# Altium schematic sheet CH32F103C-R1.SchDoc
size 436 x 317 mm
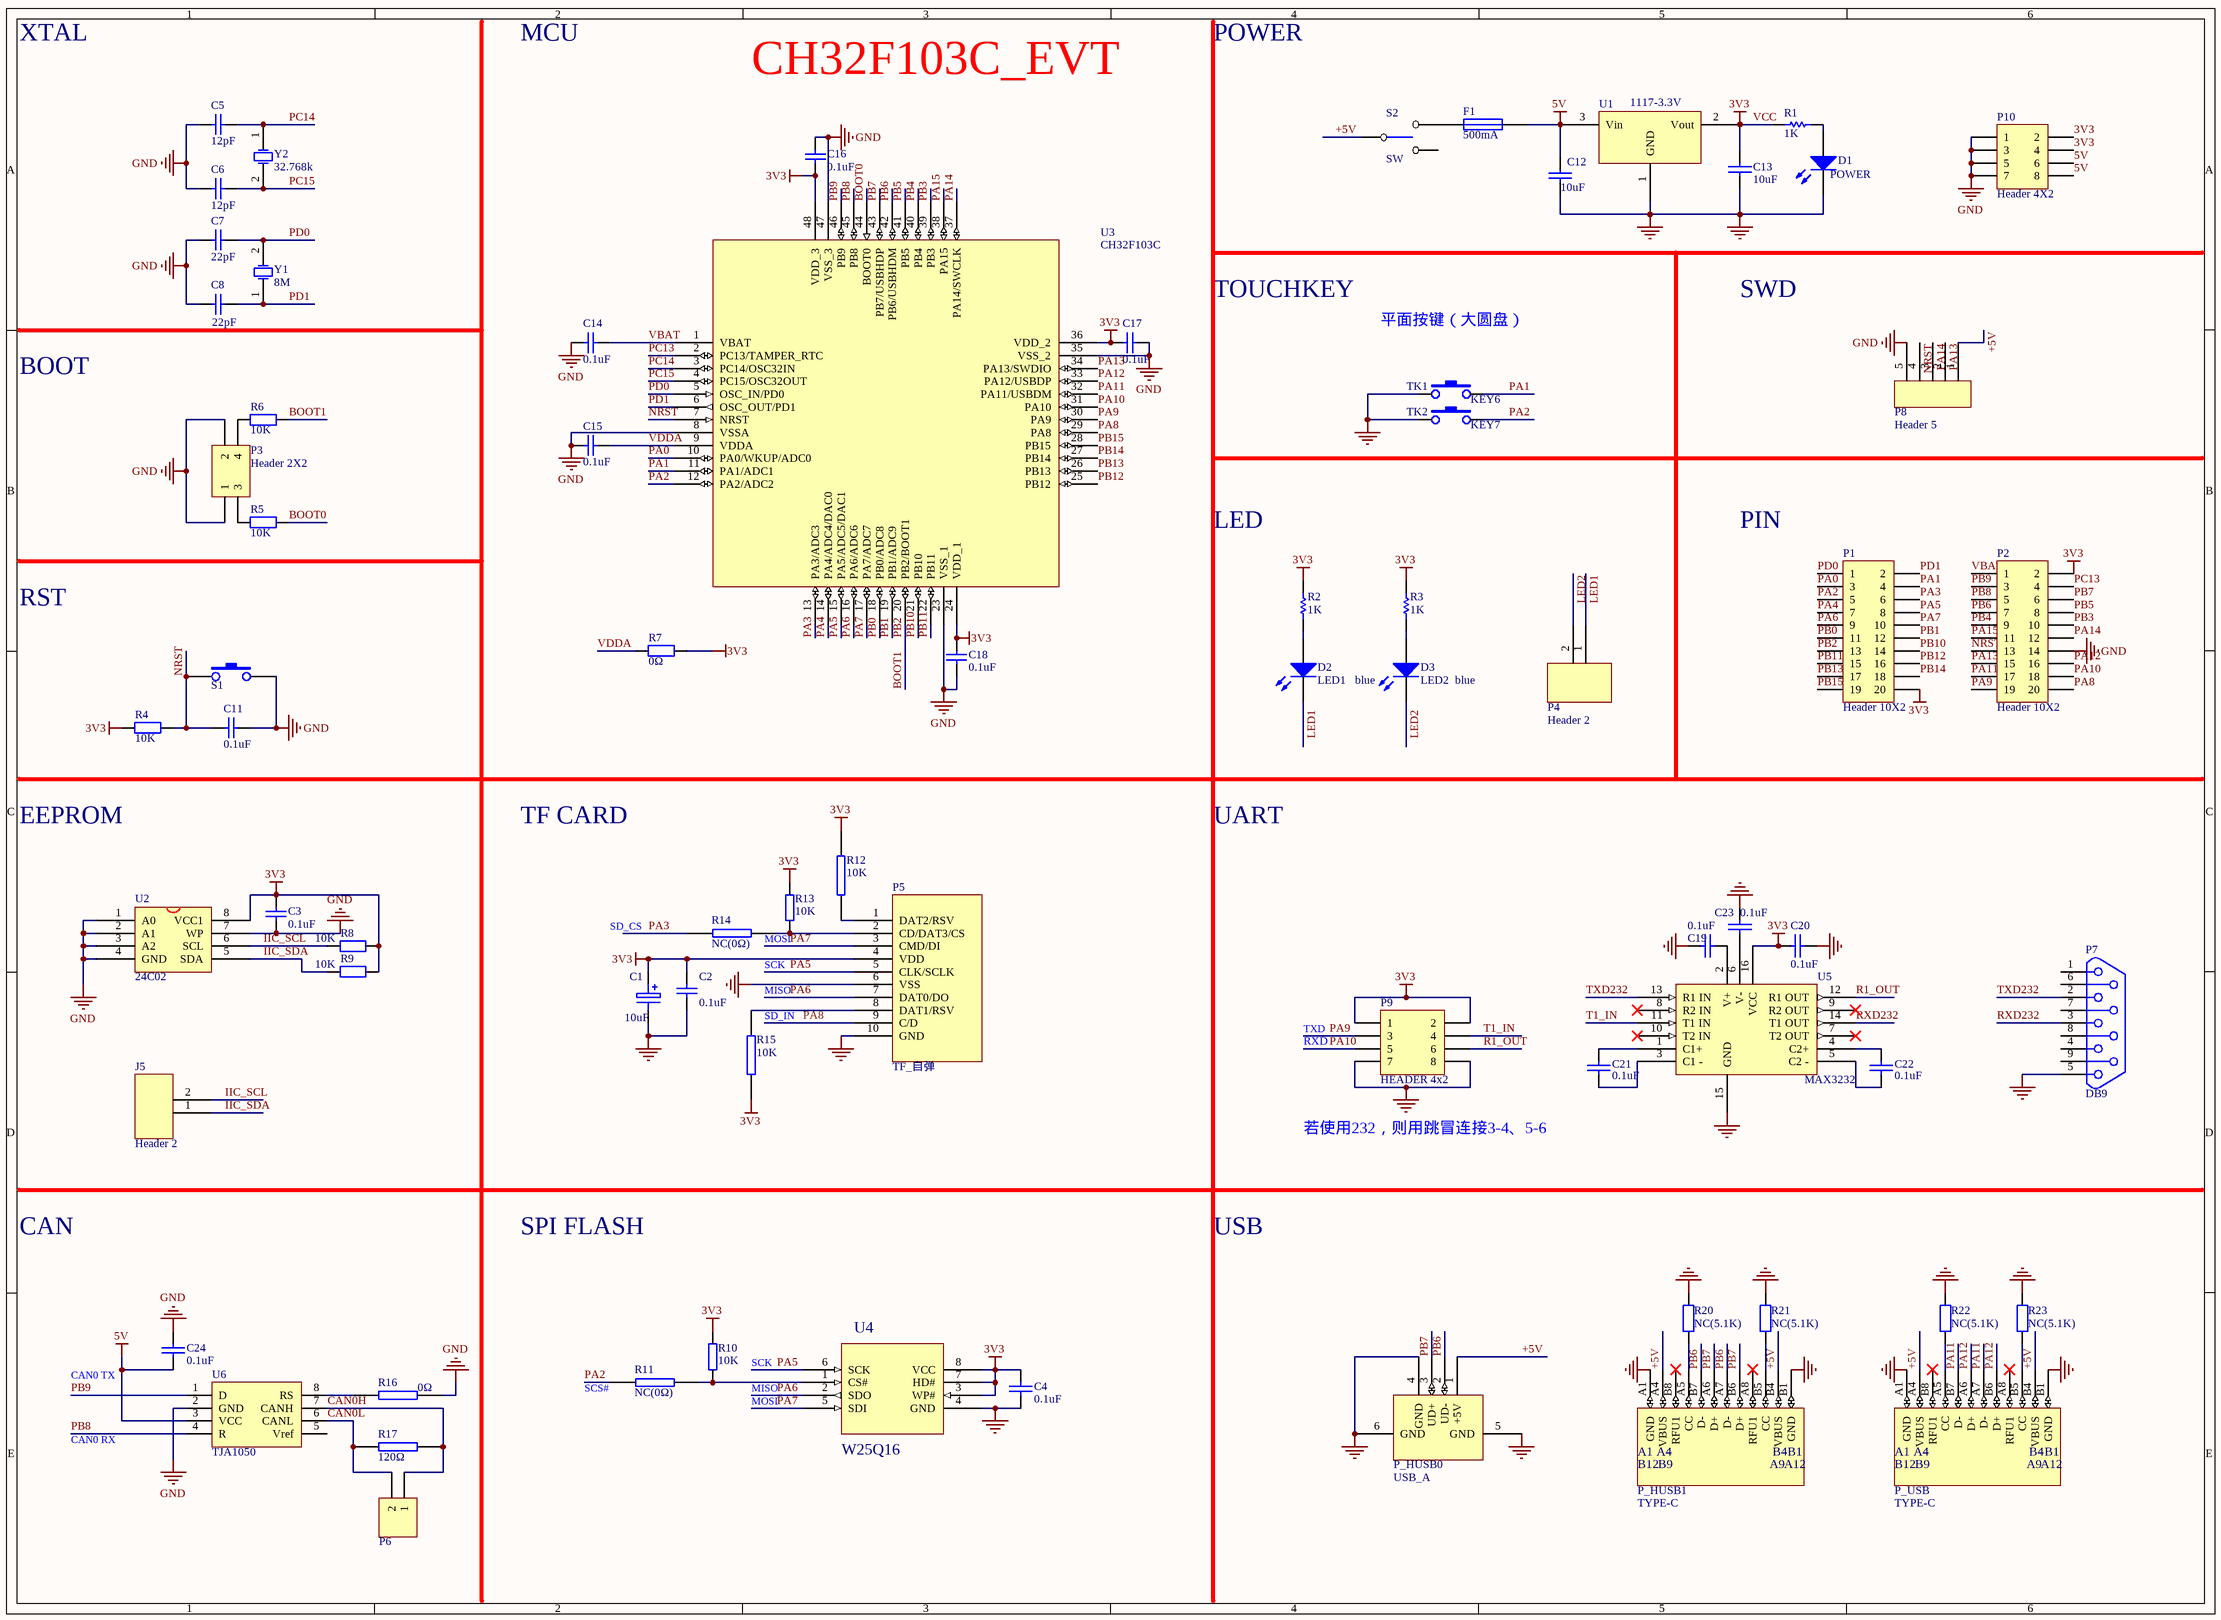
[diagram p0: CH32F103C-R1.SchDoc]

## Parts
C1  10uF  [3216]
C2  0.1uF  [0603]
C3  0.1uF  [0603]
C4  0.1uF  [0603]
C5  12pF  [0603]
C6  12pF  [0603]
C7  22pF  [0603]
C8  22pF  [0603]
C11  0.1uF  [0603]
C12  10uF  [3216]
C13  10uF  [0603]
C14  0.1uF  [0603]
C15  0.1uF  [0603]
C16  0.1uF  [0603]
C17  0.1uF  [0603]
C18  0.1uF  [0603]
C19  0.1uF  [0603]
C20  0.1uF  [0603]
C21  0.1uF  [0603]
C22  0.1uF  [0603]
C23  0.1uF  [0603]
C24  0.1uF  [0603]
D1  POWER  [0603L]
D2  LED1   blue  [0603L]
D3  LED2  blue  [0603L]
F1  500mA  [0603]
J5  Header 2  [SIP2 - 40mil]
P1  Header 10X2  [IDC20]
P2  Header 10X2  [IDC20]
P3  Header 2X2  [HDR2X2]
P4  Header 2  [SIP2 - 40mil]
P5  TF_自弹  [TF_CARD]
P6  Header 2  [PORT2 4.5MM]  (value not drawn)
P7  DB9  [DB9]
P8  Header 5  [SIP5 - 40mil]
P9  HEADER 4x2  [IDC8-2.54mm]
P10  Header 4X2  [IDC8]
P_HUSB0  USB_A  [USBA-l]
P_HUSB1  TYPE-C  [TYPE-C-Receptacle-2.0]
P_USB  TYPE-C  [TYPE-C-Receptacle-2.0]
R1  1K  [0603]
R2  1K  [0603]
R3  1K  [0603]
R4  10K  [0603]
R5  10K  [0603]
R6  10K  [0603]
R7  0Ω  [0603]
R8  10K  [0603]
R9  10K  [0603]
R10  10K  [0603]
R11  NC(0Ω)  [0603]
R12  10K  [0603]
R13  10K  [0603]
R14  NC(0Ω)  [0603]
R15  10K  [0603]
R16  0Ω  [0603]
R17  120Ω  [0603]
R20  NC(5.1K)  [0603]
R21  NC(5.1K)  [0603]
R22  NC(5.1K)  [0603]
R23  NC(5.1K)  [0603]
S1  KEY  [贴片按键]  (value not drawn)
S2  SW  [KEY2]
TK1  KEY6  [KEY68]
TK2  KEY7  [KEY68]
U1  1117-3.3V  [SOT-223]
U2  24C02  [SOP8]
U3  CH32F103C  [LQFP48]
U4  W25Q16  [016 SO-8]
U5  MAX3232  [SO-16]
U6  TJA1050  [SOP8]
Y1  8M  [XT62/28]
Y2  32.768k  [FC-135]

## Nets
3V3: C1.1 C2.1 C3.2 C4.2 C13.1 C16.2 C17.2 C18.2 C20.2 P1.20 P2.2 P5.4(VDD) P9.1 P9.2 P10.2 P10.4 R1.2 R2.1 R3.1 R4.2 R7.1 R8.1 R9.1 R10.2 R12.2 R13.2 R15.1 U1.2(Vout) U2.8(VCC1) U3.24(VDD_1) U3.36(VDD_2) U3.48(VDD_3) U4.3(WP#) U4.7(HD#) U4.8(VCC) U5.16(VCC)  [also labelled VCC]
5V: C12.1 C24.2 F1.2 P10.6 P10.8 U1.3(Vin) U6.3(VCC)
GND: C1.2 C2.2 C3.1 C4.1 C5.2 C6.2 C7.1 C8.1 C11.1 C12.2 C13.2 C14.2 C15.2 C16.1 C17.1 C18.1 C19.2 C20.1 C23.2 C24.1 D1.2(K) P2.14 P3.1 P3.2 P5.6(VSS) P5.10(GND) P7.5 P8.5 P9.7 P9.8 P10.1 P10.3 P10.5 P10.7 P_HUSB0.4(GND) P_HUSB0.5(GND) P_HUSB0.6(GND) P_HUSB1.A1(GND) P_HUSB1.B1(GND) P_USB.A1(GND) P_USB.B1(GND) R16.1 R20.2 R21.2 R22.2 R23.2 S1.3 TK1.3 TK2.3 U1.1(GND) U2.1(A0) U2.2(A1) U2.3(A2) U2.4(GND) U2.7(WP) U3.8(VSSA) U3.23(VSS_1) U3.35(VSS_2) U3.47(VSS_3) U4.4(GND) U5.15(GND) U6.2(GND)
V+: C19.1 U5.2(V+)
V-: C23.1 U5.6(V-)
+5V: P8.1 P_HUSB0.1(+5V) P_HUSB1.A4(VBUS) P_HUSB1.B4(VBUS) P_USB.A4(VBUS) P_USB.B4(VBUS) S2.1
BOOT0: R5.1 U3.44(BOOT0)
BOOT1: P1.13 R6.1 U3.20(PB2/BOOT1)  [also labelled PB2]
CAN0H: P6.1 R17.1 U6.7(CANH)
CAN0L: P6.2 R17.2 U6.6(CANL)
IIC_SCL: J5.2 R8.2 U2.6(SCL)
IIC_SDA: J5.1 R9.2 U2.5(SDA)
LED1: D2.2(K) P4.1
LED2: D3.2(K) P4.2
NRST: C11.2 P2.13 P8.4 R4.1 S1.1 U3.7(NRST)
PA0: P1.3 U3.10(PA0/WKUP/ADC0)
PA1: P1.4 TK1.1 U3.11(PA1/ADC1)
PA2: P1.5 R11.2 TK2.1 U3.12(PA2/ADC2)
PA3: P1.6 R14.2 U3.13(PA3/ADC3)
PA4: P1.7 U3.14(PA4/ADC4/DAC0)
PA5: P1.8 P5.5(CLK/SCLK) U3.15(PA5/ADC5/DAC1) U4.6(SCK)
PA6: P1.9 P5.7(DAT0/DO) U3.16(PA6/ADC6) U4.2(SDO)
PA7: P1.10 P5.3(CMD/DI) U3.17(PA7/ADC7) U4.5(SDI)
PA8: P2.20 P5.9(C/D) U3.29(PA8)
PA9: P2.19 P9.3 U3.30(PA9)
PA10: P2.18 P9.5 U3.31(PA10)
PA11: P2.17 P_USB.A7(D-) P_USB.B7(D-) U3.32(PA11/USBDM)
PA12: P2.16 P_USB.A6(D+) P_USB.B6(D+) U3.33(PA12/USBDP)
PA13: P2.15 P8.2 U3.34(PA13/SWDIO)
PA14: P2.12 P8.3 U3.37(PA14/SWCLK)
PA15: P2.11 U3.38(PA15)
PB0: P1.11 U3.18(PB0/ADC8)
PB1: P1.12 U3.19(PB1/ADC9)
PB3: P2.10 U3.39(PB3)
PB4: P2.9 U3.40(PB4)
PB5: P2.8 U3.41(PB5)
PB6: P2.7 P_HUSB0.2(UD-) P_HUSB1.A7(D-) P_HUSB1.B7(D-) U3.42(PB6/USBHDM)
PB7: P2.6 P_HUSB0.3(UD+) P_HUSB1.A6(D+) P_HUSB1.B6(D+) U3.43(PB7/USBHDP)
PB8: P2.5 U3.45(PB8) U6.4(R)
PB9: P2.3 U3.46(PB9) U6.1(D)
PB10: P1.14 U3.21(PB10)
PB11: P1.15 U3.22(PB11)
PB12: P1.16 U3.25(PB12)
PB13: P1.17 U3.26(PB13)
PB14: P1.18 U3.27(PB14)
PB15: P1.19 U3.28(PB15)
PC13: P2.4 U3.2(PC13/TAMPER_RTC)
PC14: C5.1 U3.3(PC14/OSC32IN) Y2.1(OSC1)
PC15: C6.1 U3.4(PC15/OSC32OUT) Y2.2(OSC2)
PD0: C7.2 P1.1 U3.5(OSC_IN/PD0) Y1.2(OSC2)
PD1: C8.2 P1.2 U3.6(OSC_OUT/PD1) Y1.1(OSC1)
R1_OUT: P9.6 U5.12(R1_OUT)
RXD232: P7.3 U5.14(T1_OUT)
T1_IN: P9.4 U5.11(T1_IN)
TXD232: P7.2 U5.13(R1_IN)
VBAT: C14.1 P2.1 U3.1(VBAT)
VDDA: C15.1 R7.2 U3.9(VDDA)
NetC21_1: C21.1 U5.1(C1+)
NetC21_2: C21.2 U5.3(C1_-)
NetC22_1: C22.1 U5.4(C2+)
NetC22_2: C22.2 U5.5(C2_-)
NetD1_1: D1.1(A) R1.1
NetD2_1: D2.1(A) R2.2
NetD3_1: D3.1(A) R3.2
NetF1_1: F1.1 S2.2
NetP3_3: P3.3 R5.2
NetP3_4: P3.4 R6.2
NetP5_1: P5.1(DAT2/RSV) R12.1
NetP5_2: P5.2(CD/DAT3/CS) R13.1 R14.1
NetP5_8: P5.8(DAT1/RSV) R15.2
NetP_HUSB1_A5: P_HUSB1.A5(CC) R20.1
NetP_HUSB1_B5: P_HUSB1.B5(CC) R21.1
NetP_USB_A5: P_USB.A5(CC) R22.1
NetP_USB_B5: P_USB.B5(CC) R23.1
NetR10_1: R10.1 R11.1 U4.1(CS#)
NetR16_2: R16.2 U6.8(RS)

Not connected (* = marked no-connect by the designer): P7 1 4 6 7 8 9; P_HUSB1 A8(RFU1)* B8(RFU1)*; P_USB A8(RFU1)* B8(RFU1)*; S2 3; U5 7(T2_OUT)* 8(R2_IN)* 9(R2_OUT)* 10(T2_IN)*; U6 5(Vref)

## Notes on the sheet
- XTAL
- MCU
- CH32F103C_EVT
- POWER
- TOUCHKEY
- 平面按键（大圆盘）
- SWD
- BOOT
- LED
- PIN
- RST
- EEPROM
- TF CARD
- UART
- SD_CS
- MOSI
- SCK
- MISO
- (near R15) SD_IN
- RXD
- TXD
- 若使用232，则用跳冒连接3-4、5-6
- CAN
- SPI FLASH
- USB
- CAN0 TX
- (near R10) SCK
- CAN0 RX
- (near R11) SCS#
- (near R10) MISO
- (in symbol TYPE-C1) B12; B9; A9; A12

## Library data of the parts
C1 = ELECTRO1: Electrolytic Capacitor; Value: 10uF/16V
C2 C5-C8 C11 = Cap: Capacitor; Published: 8-Jun-2000; Publisher: Altium Limited
  C2: Revision: July-2002: Re-released for DXP Platform.; Value: 0.1uF
  C5-C8: LatestRevisionDate: 17-Jul-2002; LatestRevisionNote: Re-released for DXP Platform.; PackageReference: RAD-0.3
  C11: LatestRevisionDate: 17-Jul-2002; LatestRevisionNote: Re-released for DXP Platform.; PackageReference: RAD-0.3; Value: 0.1uF
C3 C14-C18 = Cap: Capacitor; Value: 15pF; Published: 8-Jun-2000; LatestRevisionDate: 17-Jul-2002; LatestRevisionNote: Re-released for DXP Platform.; PackageReference: RAD-0.3; Publisher: Altium Limited
C4 C12 C13 C19-C24 = CAP: Capacitor
D1-D3 = LED0: Typical INFRARED GaAs LED; Published: 8-Jun-2000; LatestRevisionDate: 08-Jul-2005; LatestRevisionNote: Mech Layer 1 removed.; PackageReference: LED-0; Publisher: Altium Limited
F1 = FUSE1: Fuse
J5 P4 P8 = 2HEAD
P1 P2 = Header 10X2: Header, 10-Pin, Dual row; LatestRevisionDate: 17-Jul-2002; LatestRevisionNote: Re-released for DXP Platform.; Publisher: Altium Limited
P3 = Header 2X2: Header, 2-Pin, Dual row; LatestRevisionDate: 17-Jul-2002; LatestRevisionNote: Re-released for DXP Platform.; Publisher: Altium Limited
P6 = Header 2: Header, 2-Pin; LatestRevisionDate: 17-Jul-2002; LatestRevisionNote: Re-released for DXP Platform.; Publisher: Altium Limited
P9 = HEADER 4x2: Header, 4-Pin, Dual row
P10 = Header 4X2: Header, 4-Pin, Dual row; LatestRevisionDate: 17-Jul-2002; LatestRevisionNote: Re-released for DXP Platform.; Publisher: Altium Limited
P_HUSB0 = USB: USB Port
P_HUSB1 P_USB = TYPE-C1
R1-R3 = Res Semi: Semiconductor Resistor; Published: 8-Jun-2000; LatestRevisionDate: 17-Jul-2002; LatestRevisionNote: Re-released for DXP Platform.; PackageReference: AXIAL-0.5; Publisher: Altium Limited; Value: 1K
R4-R6 R8 R9 R20-R23 = Res2: Resistor
  R4-R6 R8 R9: Published: 8-Jun-2000; LatestRevisionDate: 17-Jul-2002; LatestRevisionNote: Re-released for DXP Platform.; PackageReference: AXIAL-0.4; Publisher: Altium Limited; Value: 10K
R7 = Res2: Resistor; Value: 10K; Published: 8-Jun-2000; LatestRevisionDate: 17-Jul-2002; LatestRevisionNote: Re-released for DXP Platform.; PackageReference: AXIAL-0.4; Publisher: Altium Limited
R10 R13 = DZ
R11 R12 R14-R17 = RES2
TK1 TK2 = KEY
U2 = 24C256
U3 = CH32F103C: ARM M3 MCU with USB device & USB host & ADC & 12bit DAC & Touch Key & CAN
U4 = Pro89C.tmp_25F512_2
U5 = MAX232CPE(16): +-15KV ESD-PROTECTED, +5V RS-232 TRANSCEIVERS
U6 = Component_1
Y1 Y2 = XTAL: Crystal Oscillator; Published: 8-Jun-2000; LatestRevisionDate: 17-Jul-2002; LatestRevisionNote: Re-released for DXP Platform.; PackageReference: R38; Publisher: Altium Limited